# Altium schematic sheet C2LH_B2B.SchDoc
size A3; DocumentNumber: 2; SheetNumber: 8; SheetTotal: 8
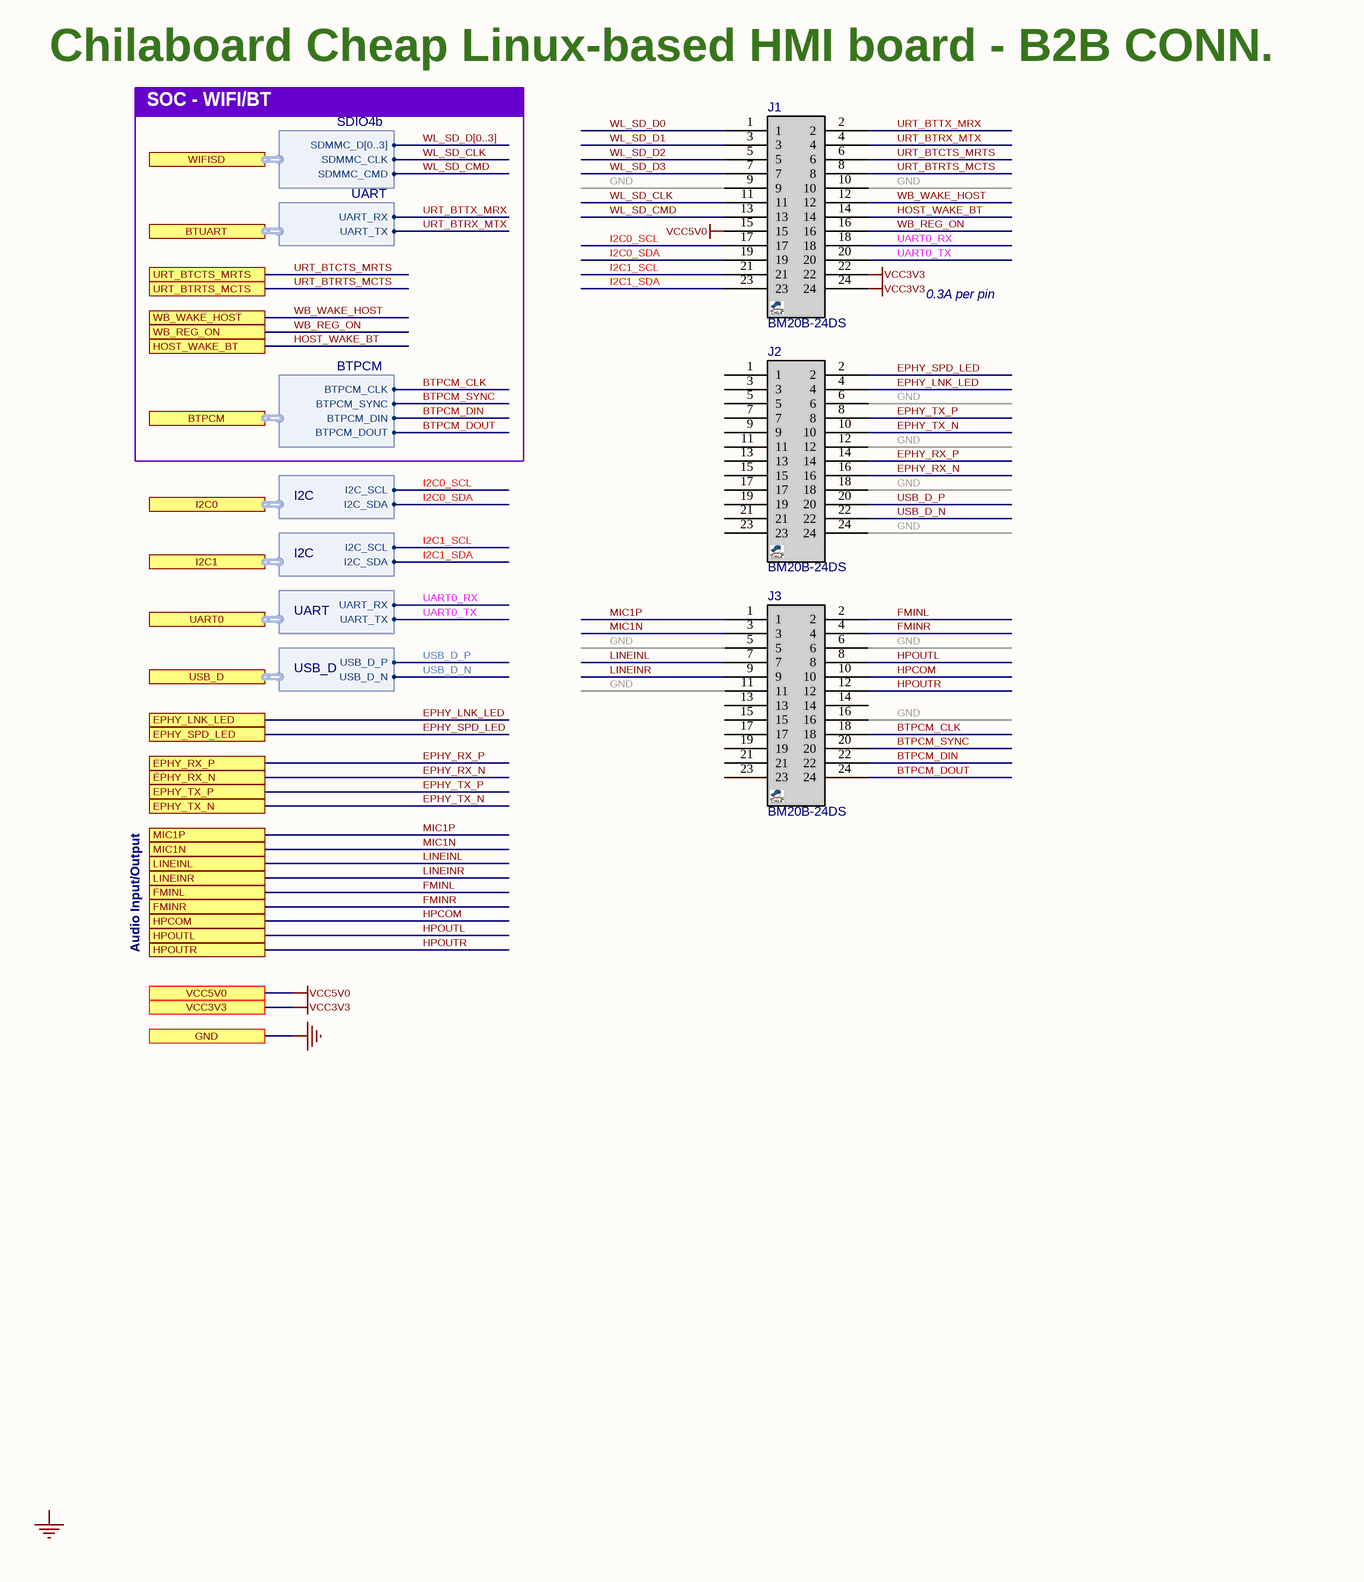
[diagram p0: C2LH_B2B.SchDoc]

## Parts
J1  BM20B-24DS  [BM20B_24DS]
J2  BM20B-24DS  [BM20B_24DS]
J3  BM20B-24DS  [BM20B_24DS]

## Ports
BTPCM (harness BTPCM), BTUART (harness UART), EPHY_LNK_LED, EPHY_RX_N, EPHY_RX_P, EPHY_SPD_LED, EPHY_TX_N, EPHY_TX_P, FMINL, FMINR, GND, HOST_WAKE_BT, HPCOM, HPOUTL, HPOUTR, I2C0 (harness I2C), I2C1 (harness I2C), LINEINL, LINEINR, MIC1N, MIC1P, UART0 (harness UART), URT_BTCTS_MRTS, URT_BTRTS_MCTS, USB_D (harness USB_D), VCC3V3, VCC5V0, WB_REG_ON, WB_WAKE_HOST, WIFISD (harness SDIO4b)

## Harnesses
UART: UART_RX, UART_TX
USB_D: USB_D_P, USB_D_N
SDIO4b: SDMMC_CMD, SDMMC_D[0..3], SDMMC_CLK
I2C: I2C_SCL, I2C_SDA
BTPCM: BTPCM_SYNC, BTPCM_CLK, BTPCM_DOUT, BTPCM_DIN

## Nets
GND: J1.9 J1.10 J2.6 J2.12 J2.18 J2.24 J3.5 J3.6 J3.11 J3.16 ; port GND
VCC3V3: J1.22 J1.24 ; port VCC3V3
VCC5V0: J1.15 ; port VCC5V0
BTPCM_CLK: J3.18 ; port BTPCM.BTPCM_CLK
BTPCM_DIN: J3.22 ; port BTPCM.BTPCM_DIN
BTPCM_DOUT: J3.24 ; port BTPCM.BTPCM_DOUT
BTPCM_SYNC: J3.20 ; port BTPCM.BTPCM_SYNC
EPHY_LNK_LED: J2.4 ; port EPHY_LNK_LED
EPHY_RX_N: J2.16 ; port EPHY_RX_N
EPHY_RX_P: J2.14 ; port EPHY_RX_P
EPHY_SPD_LED: J2.2 ; port EPHY_SPD_LED
EPHY_TX_N: J2.10 ; port EPHY_TX_N
EPHY_TX_P: J2.8 ; port EPHY_TX_P
FMINL: J3.2 ; port FMINL
FMINR: J3.4 ; port FMINR
HOST_WAKE_BT: J1.14 ; port HOST_WAKE_BT
HPCOM: J3.10 ; port HPCOM
HPOUTL: J3.8 ; port HPOUTL
HPOUTR: J3.12 ; port HPOUTR
I2C0_SCL: J1.17 ; port I2C0.I2C_SCL
I2C0_SDA: J1.19 ; port I2C0.I2C_SDA
I2C1_SCL: J1.21 ; port I2C1.I2C_SCL
I2C1_SDA: J1.23 ; port I2C1.I2C_SDA
LINEINL: J3.7 ; port LINEINL
LINEINR: J3.9 ; port LINEINR
MIC1N: J3.3 ; port MIC1N
MIC1P: J3.1 ; port MIC1P
UART0_RX: J1.18 ; port UART0.UART_RX
UART0_TX: J1.20 ; port UART0.UART_TX
URT_BTCTS_MRTS: J1.6 ; port URT_BTCTS_MRTS
URT_BTRTS_MCTS: J1.8 ; port URT_BTRTS_MCTS
URT_BTRX_MTX: J1.4 ; port BTUART.UART_TX
URT_BTTX_MRX: J1.2 ; port BTUART.UART_RX
USB_D_N: J2.22 ; port USB_D.USB_D_N
USB_D_P: J2.20 ; port USB_D.USB_D_P
WB_REG_ON: J1.16 ; port WB_REG_ON
WB_WAKE_HOST: J1.12 ; port WB_WAKE_HOST
WL_SD_CLK: J1.11 ; port WIFISD.SDMMC_CLK
WL_SD_CMD: J1.13 ; port WIFISD.SDMMC_CMD
WL_SD_D0: J1.1
WL_SD_D1: J1.3
WL_SD_D2: J1.5
WL_SD_D3: J1.7

Not connected (* = marked no-connect by the designer): J2 1 3 5 7 9 11 13 15 17 19 21 23; J3 13 14 15 17 19 21 23

## Buses and harness runs
bus WL_SD_D[0..3]

## Notes on the sheet
- Chilaboard Cheap Linux-based HMI board - B2B CONN.
- SOC - WIFI/BT
- 0.3A per pin
- Audio Input/Output
- Labels drawn without touching a wire or pin: GND

## Library data of the parts
J1-J3 = BM20B-24DS: DF23 Series B2B Connectors; MANF: HIROSE; DESC: Mating BM20B(0.8)-24DP-0.4V(51); MANF_P#: BM20B(0.8)-24DS-0.4V(51); PRICE: 0.1$; VALUE: BM20B-24DS